# EAGLE design I2C_4CH_PWM_MODULE (EAGLE 9.6.2)
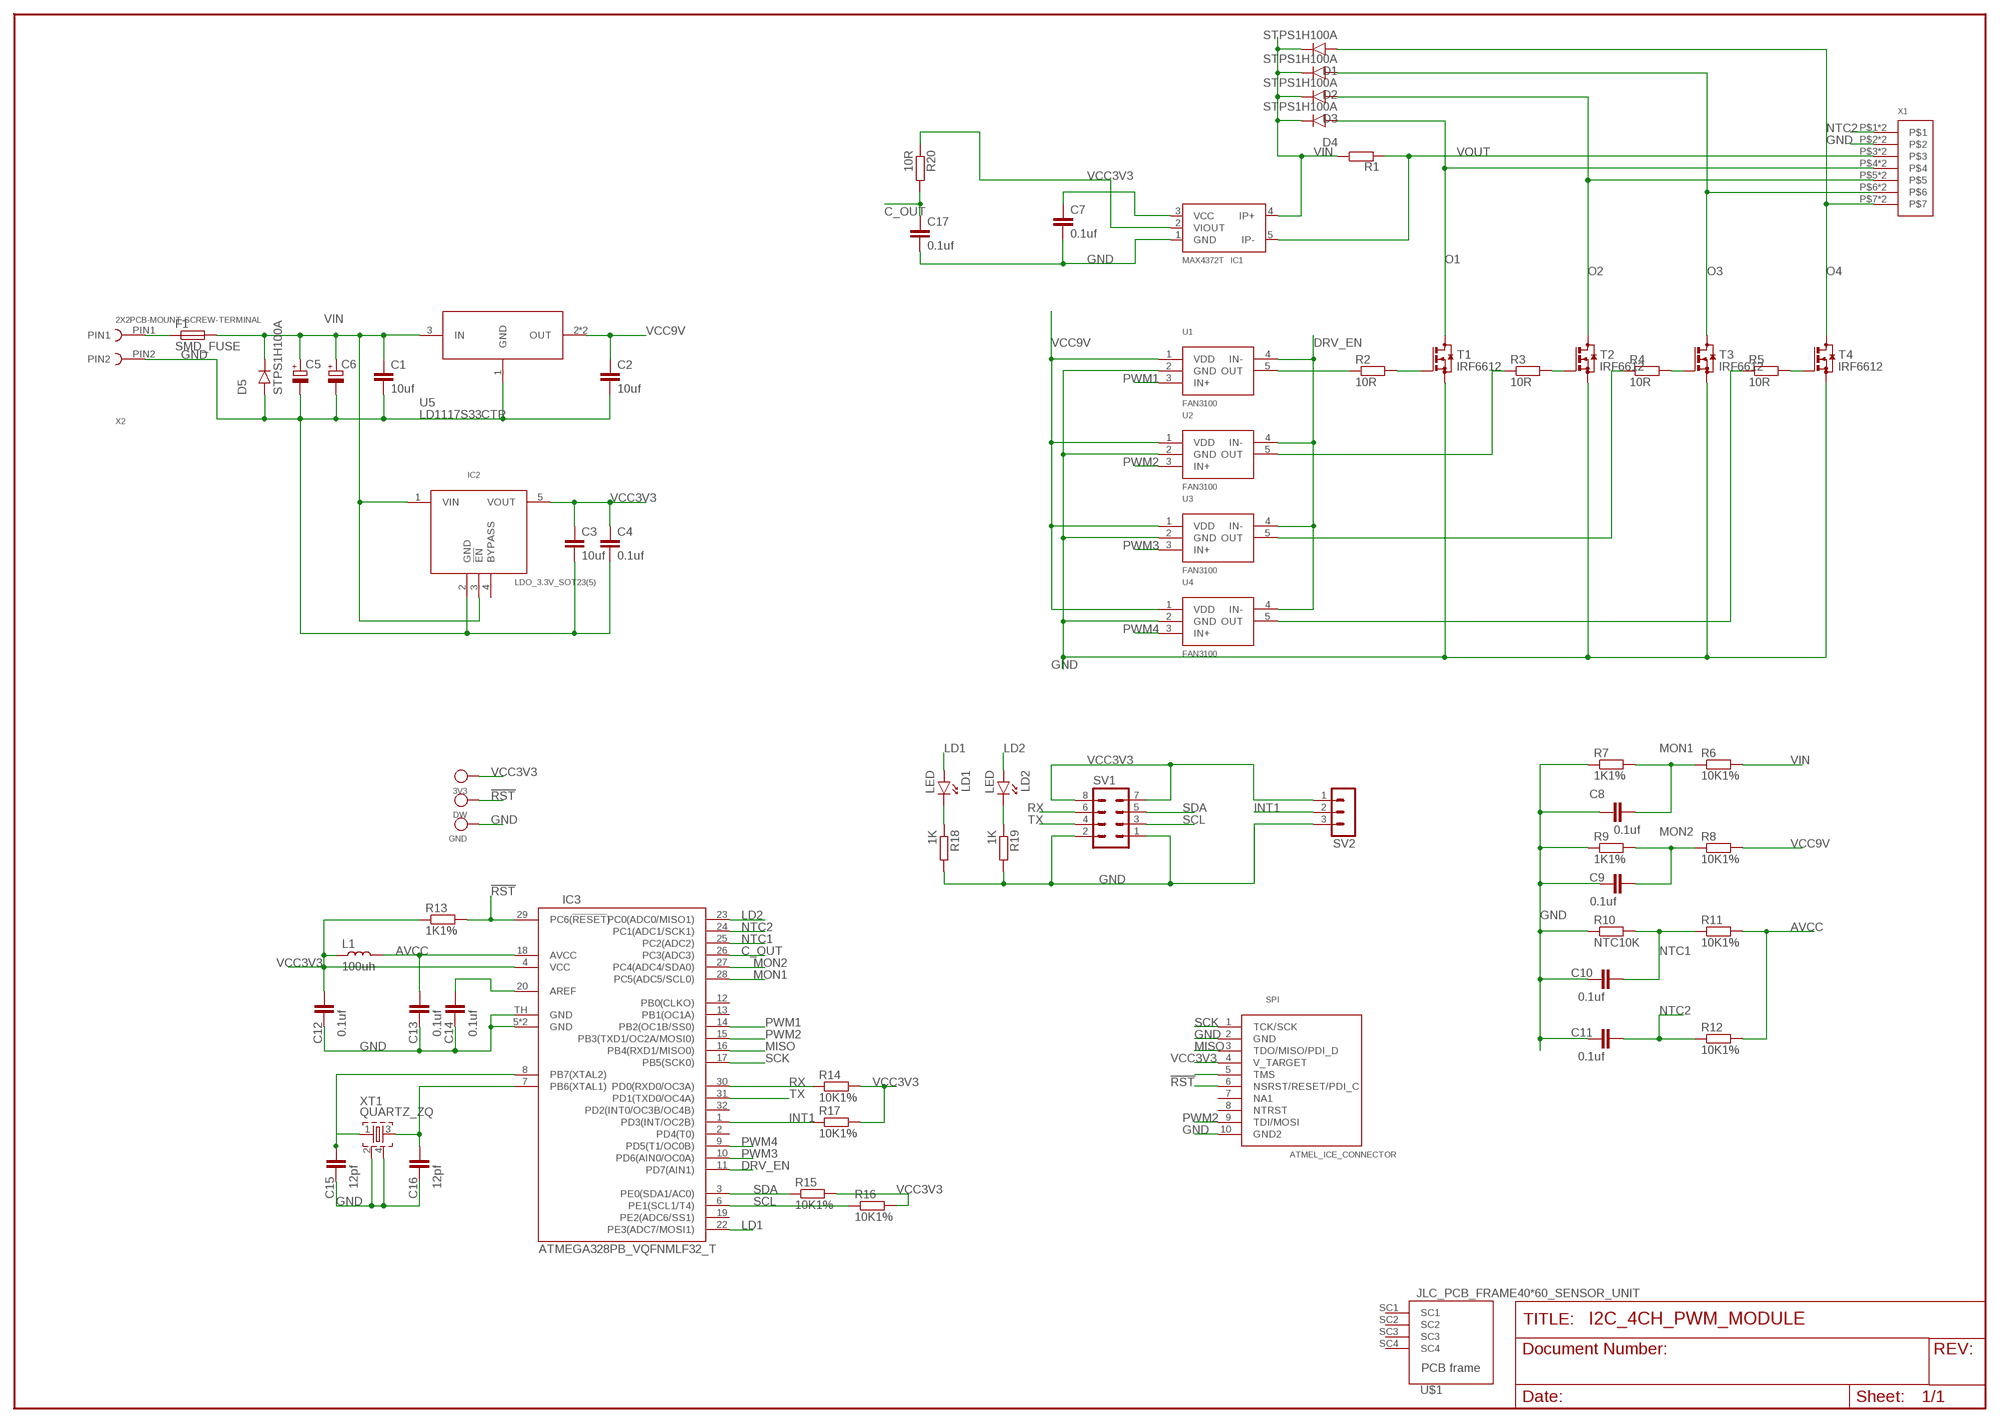
[diagram p0: schematic, sheet 1]

## Parts
3V3  TEST_POINT_D2MM  [TP]
C1  10uf  SMD_C1206  [1206]
C2  10uf  SMD_C1206  [1206]
C3  10uf  SMD_C1206  [1206]
C4  0.1uf  SMD_C0603  [0603]
C5  CPOL-EU153CLV-0605  [153CLV-0605]
C6  CPOL-EU153CLV-0605  [153CLV-0605]
C7  0.1uf  SMD_C0603  [0603]
C8  0.1uf  SMD_C0603  [0603]
C9  0.1uf  SMD_C0603  [0603]
C10  0.1uf  SMD_C0603  [0603]
C11  0.1uf  SMD_C0603  [0603]
C12  0.1uf  SMD_C0603  [0603]
C13  0.1uf  SMD_C0603  [0603]
C14  0.1uf  SMD_C0603  [0603]
C15  12pf  SMD_C0603  [0603]
C16  12pf  SMD_C0603  [0603]
C17  0.1uf  SMD_C0603  [0603]
D1  STPS1H100A  [SMA403D]
D2  STPS1H100A  [SMA403D]
D3  STPS1H100A  [SMA403D]
D4  STPS1H100A  [SMA403D]
D5  STPS1H100A  [SMA403D]
DW  TEST_POINT_D2MM  [TP]
F1  SMD_FUSE  [SMD_2410_FUSE_NOK]
GND  TEST_POINT_D2MM  [TP]
IC1  MAX4372T  [SOT-23(5)]
IC2  LDO_3.3V_SOT23(5)  [SOT-23(5)]
IC3  ATMEGA328PB_VQFNMLF32_T  [MLF32-TH]
L1  100uh  SMD_L0603  [0603]
LD1  LED  [3MM_DIP_LED]
LD2  LED  [3MM_DIP_LED]
R1  SMS-0  [SMS-0]
R2  10R  SMD_R0603  [0603]
R3  10R  SMD_R0603  [0603]
R4  10R  SMD_R0603  [0603]
R5  10R  SMD_R0603  [0603]
R6  10K1%  SMD_R0603  [0603]
R7  1K1%  SMD_R0603  [0603]
R8  10K1%  SMD_R0603  [0603]
R9  1K1%  SMD_R0603  [0603]
R10  NTC10K  SMD_R0603  [0603]
R11  10K1%  SMD_R0603  [0603]
R12  10K1%  SMD_R0603  [0603]
R13  1K1%  SMD_R0603  [0603]
R14  10K1%  SMD_R0603  [0603]
R15  10K1%  SMD_R0603  [0603]
R16  10K1%  SMD_R0603  [0603]
R17  10K1%  SMD_R0603  [0603]
R18  1K  SMD_R0603  [0603]
R19  1K  SMD_R0603  [0603]
R20  10R  SMD_R0603  [0603]
SPI  ATMEL_ICE_CONNECTOR  [MINI10P_SPI/JTAG/PDI]
SV1  MA04-2  [MA04-2]
SV2  MA03-1  [MA03-1]
T1  IRF6612  [DIRECTFET_IRF6612]
T2  IRF6612  [DIRECTFET_IRF6612]
T3  IRF6612  [DIRECTFET_IRF6612]
T4  IRF6612  [DIRECTFET_IRF6612]
U1  FAN3100  [SOT-23(5)]
U2  FAN3100  [SOT-23(5)]
U3  FAN3100  [SOT-23(5)]
U4  FAN3100  [SOT-23(5)]
U5  LD1117S33CTR  [SOT223]
U$1  JLC_PCB_FRAME40*60_SENSOR_UNIT  [40X60_SENSOR_UNIT]
X1  WAGO250_X7  [WAGO250_FP_7X]
X2  2X2PCB-MOUNT-SCREW-TERMINAL  [2X2PCB-MOUNT-SCREW-TERMINAL]
XT1  QUARTZ_ZQ  [QUARTZ_3X3MM]

## Nets
!RST: DW.P$1 IC3.29(PC6(!RESET!)) R13.2 SPI.6(NSRST/RESET/PDI_C)
AVCC: C13.2 IC3.18(AVCC) L1.2 R11.2 R12.2
C_OUT: C17.1 IC3.26(PC3(ADC3)) R20.2
DRV_EN: IC3.11(PD7(AIN1)) U1.4(IN-) U2.4(IN-) U3.4(IN-) U4.4(IN-)
GND: C1.2 C2.2 C3.2 C4.2 C5.- C6.- C7.2 C8.1 C9.1 C10.1 C11.1 C12.1 C13.1 C14.1 C15.1 C16.1 C17.2 D5.P$2(A) GND.P$1 IC1.1(GND) IC2.2(GND) IC3.5(GND) IC3.21(GND) IC3.TH(GND) R7.1 R9.1 R10.1 R18.2 R19.2 SPI.2(GND) SPI.10(GND2) SV1.1 SV1.2 SV2.3 T1.S1(S) T1.S2(S) T2.S1(S) T2.S2(S) T3.S1(S) T3.S2(S) T4.S1(S) T4.S2(S) U1.2(GND) U2.2(GND) U3.2(GND) U4.2(GND) U5.1(GND) X1.P$2 X1.U$2 X2.PIN2 XT1.2 XT1.4
INT1: IC3.1(PD3(INT/OC2B)) R17.1 SV2.2
LD1: IC3.22(PE3(ADC7/MOSI1)) LD1.A
LD2: IC3.23(PC0(ADC0/MISO1)) LD2.A
MISO: IC3.16(PB4(RXD1/MISO0)) SPI.3(TDO/MISO/PDI_D)
MON1: C8.2 IC3.28(PC5(ADC5/SCL0)) R6.1 R7.2
MON2: C9.2 IC3.27(PC4(ADC4/SDA0)) R8.1 R9.2
N$1: LD2.K R19.1
N$2: F1.P$1 X2.PIN1
N$3: C15.2 IC3.8(PB7(XTAL2)) XT1.1
N$4: C16.2 IC3.7(PB6(XTAL1)) XT1.3
N$5: C14.2 IC3.20(AREF)
N$6: LD1.K R18.1
N$7: SPI.5(TMS)
N$8: IC1.2(VIOUT) R20.1
N$10: R2.2 T1.G
N$11: R2.1 U1.5(OUT)
N$12: R3.1 U2.5(OUT)
N$13: R3.2 T2.G
N$14: R4.1 U3.5(OUT)
N$15: R4.2 T3.G
N$16: R5.1 U4.5(OUT)
N$17: R5.2 T4.G
NTC1: C10.2 IC3.25(PC2(ADC2)) R10.2 R11.1
NTC2: C11.2 IC3.24(PC1(ADC1/SCK1)) R12.1 X1.P$1 X1.U$1
O1: D4.P$2(A) T1.D1(D) T1.D2(D) X1.P$4 X1.U$4
O2: D3.P$2(A) T2.D1(D) T2.D2(D) X1.P$5 X1.U$5
O3: D2.P$2(A) T3.D1(D) T3.D2(D) X1.P$6 X1.U$6
O4: D1.P$2(A) T4.D1(D) T4.D2(D) X1.P$7 X1.U$7
PWM1: IC3.14(PB2(OC1B/SS0)) U1.3(IN+)
PWM2: IC3.15(PB3(TXD1/OC2A/MOSI0)) SPI.9(TDI/MOSI) U2.3(IN+)
PWM3: IC3.10(PD6(AIN0/OC0A)) U3.3(IN+)
PWM4: IC3.9(PD5(T1/OC0B)) U4.3(IN+)
RX: IC3.30(PD0(RXD0/OC3A)) R14.1 SV1.6
SCK: IC3.17(PB5(SCK0)) SPI.1(TCK/SCK)
SCL: IC3.6(PE1(SCL1/T4)) R16.1 SV1.3
SDA: IC3.3(PE0(SDA1/AC0)) R15.1 SV1.5
TX: IC3.31(PD1(TXD0/OC4A)) SV1.4
VCC3V3: 3V3.P$1 C3.1 C4.1 C7.1 C12.2 IC1.3(VCC) IC2.5(VOUT) IC3.4(VCC) L1.1 R13.1 R14.2 R15.2 R16.2 R17.2 SPI.4(V_TARGET) SV1.7 SV1.8 SV2.1
VCC9V: C2.1 R8.2 U1.1(VDD) U2.1(VDD) U3.1(VDD) U4.1(VDD) U5.2(OUT) U5.4(OUT)
VIN: C1.1 C5.+ C6.+ D1.P$1(C) D2.P$1(C) D3.P$1(C) D4.P$1(C) D5.P$1(C) F1.P$2 IC1.4(IP+) IC2.1(VIN) IC2.3(!EN!) R1.1 R6.2 U5.3(IN)
VOUT: IC1.5(IP-) R1.2 X1.P$3 X1.U$3
Unconnected: IC2.4(BYPASS) IC3.2(PD4(T0)) IC3.12(PB0(CLKO)) IC3.13(PB1(OC1A)) IC3.19(PE2(ADC6/SS1)) IC3.32(PD2(INT0/OC3B/OC4B)) SPI.7(NA1) SPI.8(NTRST) U$1.SC1 U$1.SC2 U$1.SC3 U$1.SC4

## Library data of the parts
3V3 DW GND = passive_components:TEST_POINT_D2MM
C1-C4 C7-C17 = passive_components:SMD_C
C5 C6 = rcl:CPOL-EU: POLARIZED CAPACITOR, European symbol
D1-D5 = passive_components:STPS1H100A
F1 = passive_components:SMD_FUSE
IC1 = my_IC:MAX4372T
IC2 = passive_components:LDO_3.3V_SOT23(5)
IC3 = my_IC:ATMEGA328PB_VQFN
L1 = passive_components:SMD_L
LD1 LD2 = passive_components:LED
R1 = resistor-shunt:SMS-0: SMD SHUNT RESISTOR; OC_FARNELL: unknown; OC_NEWARK: unknown
R2-R20 = passive_components:SMD_R
SPI = passive_components:ATMEL_ICE_CONNECTOR
SV1 = con-lstb:MA04-2: PIN HEADER; OC_FARNELL: unknown; OC_NEWARK: unknown
SV2 = con-lstb:MA03-1: PIN HEADER; OC_FARNELL: unknown; OC_NEWARK: unknown
T1-T4 = passive_components:IRF6612
U1-U4 = passive_components:FAN3100
U5 = LD1117S33CTR:LD1117S33CTR: http://octopart.com/ld1117s33tr-stmicroelectronics-526708 Check availability <https://pricing.snapeda.com/parts/LD1117S33CTR/STMicroelectronics/view-part?ref=eda>; AVAILABILITY: In Stock; DESCRIPTION: Linear Voltage Regulator IC Positive Fixed 1 Output 800mA SOT-223; MF: STMicroelectronics; MP: LD1117S33CTR; PACKAGE: SOT-223 STMicroelectronics; PRICE: None; PURCHASE-URL: https://pricing.snapeda.com/search/part/LD1117S33CTR/?ref=eda
U$1 = passive_components:JLC_PCB_FRAME
X1 = Custom connectors:WAGO250_X7
X2 = Custom connectors:2X2PCB-MOUNT-SCREW-TERMINAL
XT1 = passive_components:QUARTZ_ZQ

## Board
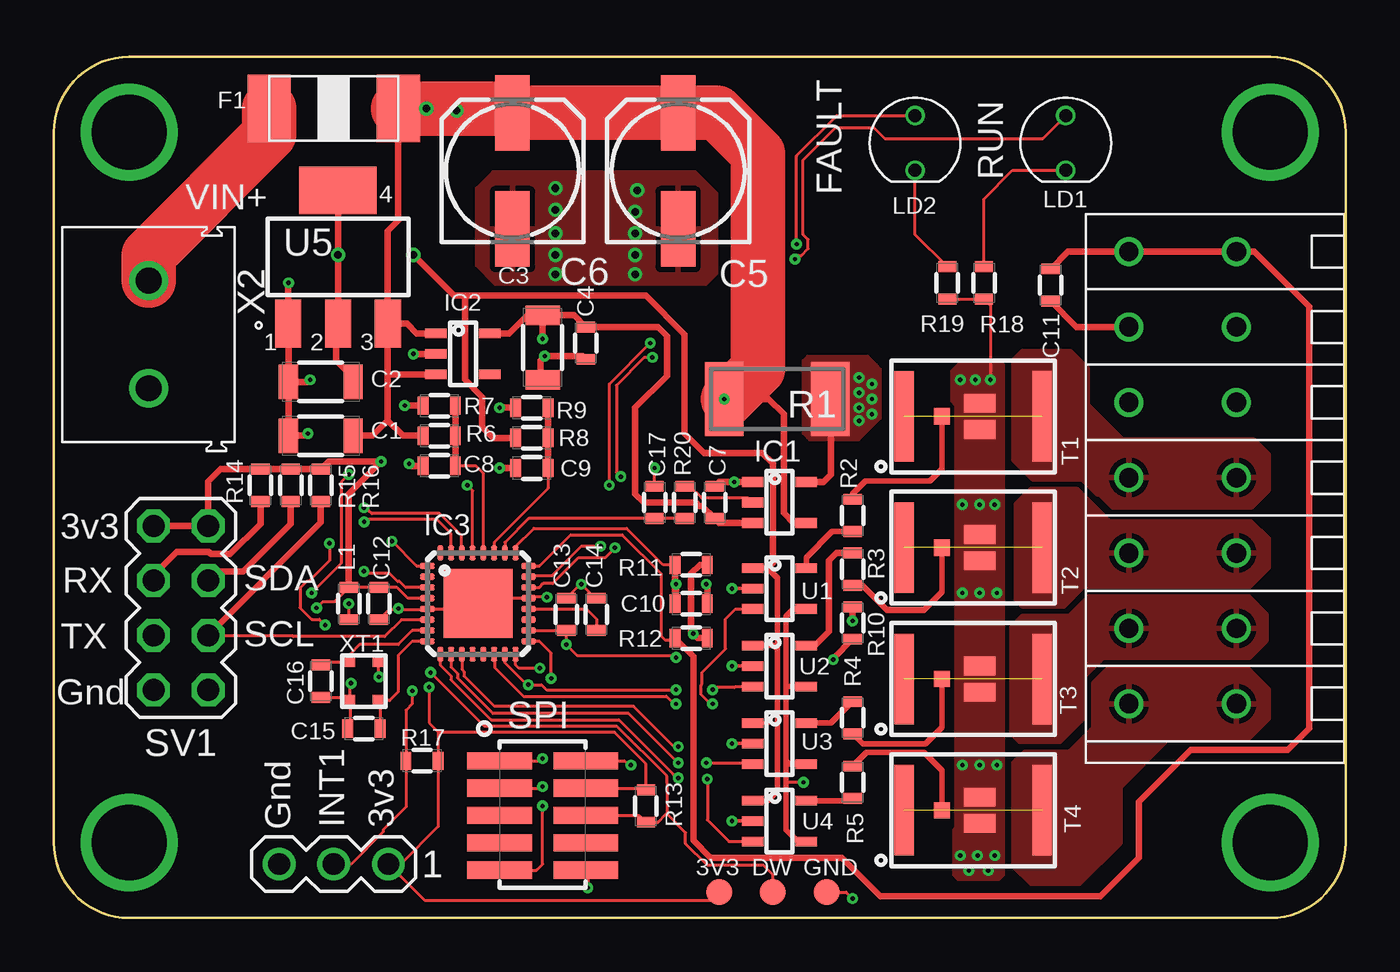
[diagram p1: board, top side]
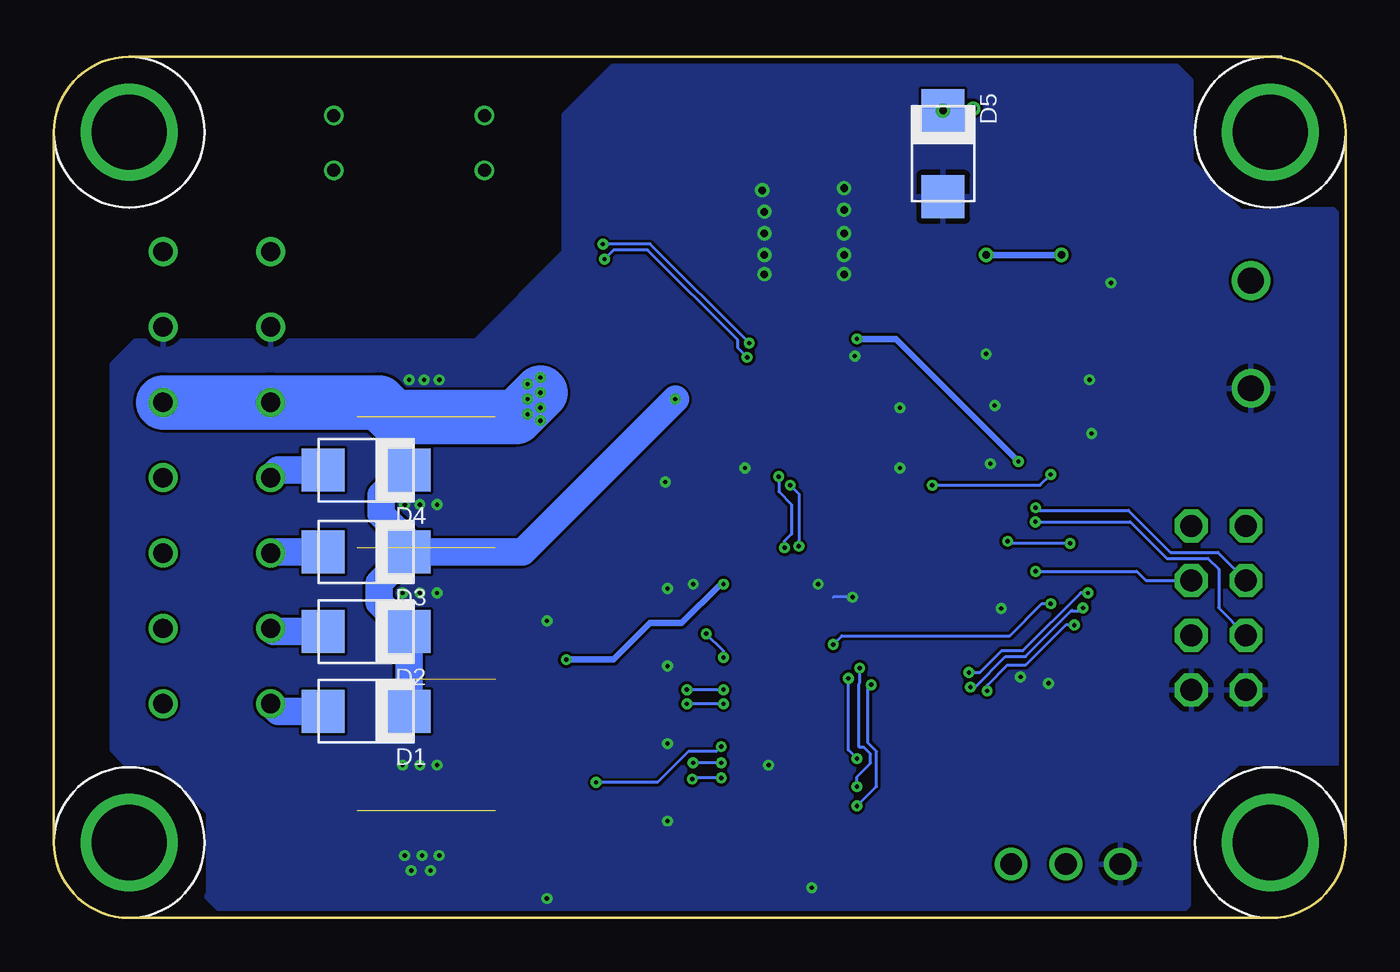
[diagram p2: board, bottom side, seen from below]

Size 60 x 40 mm. Coordinates in mm from the lower left corner, seen from the top.
Copper layers (1*16): Top 0.035mm / dielectric 1.5mm / Bottom 0.035mm
Design rules "default": minimum track width 5mil, minimum drill 0.2mm, track to track 5mil, track to pad 6mil, pad to pad 6mil, via to via 6mil, smd to smd 6mil, copper to edge 10mil, drill to drill 0.4mm, minimum pad ring 6mil, minimum via ring 6mil, stop-mask expansion 4mil, vias tented up to drill 20mil, thermal gap 10mil

### Footprints (pad centres in the part's own frame; a part is rotated, then mirrored left to right if it is on the bottom)
TP = smd 1.2 x 1.2: P$1 0,0
1206 = smd 1.6 x 0.9: 1 0,1.5; 2 0,-1.5
0603 = smd 0.85 x 0.5: 1 0,0.75; 2 0,-0.75
153CLV-0605 = smd 3.5 x 1.6: + 2.7,0; - -2.7,0
SMA403D = smd 2 x 2: P$1 -2,0; P$2 2,0
SMD_2410_FUSE_NOK = smd 2 x 3.15: P$1 -3,0; P$2 3,0
SOT-23(5) = smd 0.45 x 1: 1 -0.95,-1.25; 2 0,-1.25; 3 0.95,-1.25; 4 0.95,1.25; 5 -0.95,1.25
MLF32-TH = smd 0.7 x 0.3: 1 -2.35,1.75; 2 -2.35,1.25; 3 -2.35,0.75; 4 -2.35,0.25; 5 -2.35,-0.25; 6 -2.35,-0.75; 7 -2.35,-1.25; 8 -2.35,-1.75; 17 2.35,-1.75; 18 2.35,-1.25; 19 2.35,-0.75; 20 2.35,-0.25; 21 2.35,0.25; 22 2.35,0.75; 23 2.35,1.25; 24 2.35,1.75 | smd 0.3 x 0.7: 9 -1.75,-2.35; 10 -1.25,-2.35; 11 -0.75,-2.35; 12 -0.25,-2.35; 13 0.25,-2.35; 14 0.75,-2.35; 15 1.25,-2.35; 16 1.75,-2.35; 25 1.75,2.35; 26 1.25,2.35; 27 0.75,2.35; 28 0.25,2.35; 29 -0.25,2.35; 30 -0.75,2.35; 31 -1.25,2.35; 32 -1.75,2.35 | smd 3.2 x 3.2: TH 0,0
3MM_DIP_LED = drill 0.6: A 1.27,0; K -1.27,0
SMS-0 = smd 1.8 x 3.45: 1 2.464,0; 2 -2.464,0
MINI10P_SPI/JTAG/PDI = smd 0.8 x 3: 1 0,-4; 2 0,0; 3 1.27,-4; 4 1.27,0; 5 2.54,-4; 6 2.54,0; 7 3.81,-4; 8 3.81,0; 9 5.08,-4; 10 5.08,0
MA04-2 = drill 1.016 octagon: 1 -3.81,-1.27; 2 -3.81,1.27; 3 -1.27,-1.27; 4 -1.27,1.27; 5 1.27,-1.27; 6 1.27,1.27; 7 3.81,-1.27; 8 3.81,1.27
MA03-1 = drill 1.016: 1 -2.54,0; 2 0,0; 3 2.54,0
DIRECTFET_IRF6612 = smd 0.9 x 4.2: D1 -3.21,0; D2 3.21,0 | smd 0.75 x 0.75: G -1.455,0 | smd 1.45 x 0.87: S1 0.295,0.61; S2 0.295,-0.61
SOT223 = smd 2.235 x 1.219: 1 -3.099,2.311; 2 -3.099,0; 3 -3.099,-2.311 | smd 2.2 x 3.6: 4 3.099,0
40X60_SENSOR_UNIT = drill 3.5: SC1 3.5,56.5; SC2 36.5,56.5; SC3 3.5,3.5; SC4 36.5,3.5
WAGO250_FP_7X = drill 0.9: P$1 0,5; P$2 3.5,5; P$3 7,5; P$4 10.5,5; P$5 14,5; P$6 17.5,5; P$7 21,5; U$1 0,0; U$2 3.5,0; U$3 7,0; U$4 10.5,0; U$5 14,0; U$6 17.5,0; U$7 21,0
2X2PCB-MOUNT-SCREW-TERMINAL = drill 1.2: PIN1 0,2.5; PIN2 0,-2.5
QUARTZ_3X3MM = smd 0.5 x 0.5: 1 -0.65,0.9; 2 0.65,0.9; 3 0.65,-0.9; 4 -0.65,-0.9

### Placement (x,y rotation side)
3V3  30.9,1.2 0 top
C1  12.4,22.4 270 top
C2  12.4,24.9 270 top
C3  22.7,26.5 0 top
C4  24.7,26.7 0 top
C5  29,34.7 90 top
C6  21.3,34.7 90 top
C7  30.7,19.3 180 top
C8  17.9,21 90 top
C9  22.2,20.9 90 top
C10  29.6,14.6 270 top
C11  46.3,29.4 180 top
C12  15.1,14.6 180 top
C13  23.8,14.1 0 top
C14  25.2,14.1 0 top
C15  14.4,8.8 90 top
C16  12.4,11 180 top
C17  27.9,19.3 180 top
D1  45.5,9.6 180 bottom
D2  45.5,13.3 180 bottom
D3  45.5,17 180 bottom
D4  45.5,20.8 180 bottom
D5  18.7,35.5 270 bottom
DW  33.4,1.2 0 top
F1  13,37.6 0 top
GND  35.9,1.2 0 top
IC1  33.7,19.3 270 top
IC2  19,26.2 270 top
IC3  19.7,14.6 0 top
L1  13.7,14.6 0 top
LD1  47,36 90 top
LD2  40,36 90 top
R1  33.6,24.1 180 top
R2  37.1,18.7 180 top
R3  37.1,16.2 0 top
R4  37.1,9.3 0 top
R5  37.1,6.3 180 top
R6  17.9,22.4 270 top
R7  17.9,23.8 90 top
R8  22.2,22.3 270 top
R9  22.2,23.7 90 top
R10  37.1,13.7 0 top
R11  29.6,16.4 90 top
R12  29.6,13 90 top
R13  27.5,5.2 0 top
R14  9.6,20.1 180 top
R15  11,20.1 180 top
R16  12.4,20.1 180 top
R17  17.1,7.3 90 top
R18  43.2,29.5 0 top
R19  41.5,29.5 0 top
R20  29.3,19.3 0 top
SPI  24.7,7.3 270 top
SV1  5.9,14.4 90 top
SV2  13,2.5 180 top
T1  42.7,23.3 0 top
T2  42.7,17.2 0 top
T3  42.7,11.1 0 top
T4  42.7,5 0 top
U1  33.7,15.3 270 top
U2  33.7,11.7 270 top
U3  33.7,8.1 270 top
U4  33.7,4.5 270 top
U5  13.2,30.7 90 top
U$1  0,0 90 bottom
X1  49.93,30.95 270 top
X2  4.4,27.1 0 top
XT1  14.4,11 180 top

### Tracks (layer width: path | path; a pad name or v marks a point on that pad's centre or on a via)
!RST  (via drill 0.2)
  Top 0.15: SPI.6 27.19,4.76 R13.2 28.05,4.45 28.45,4.85 | 28.45,4.85 28.5,4.9 28.5,6.25 28.47,6.28 28.47,6.59 26.16,8.9 20,8.9 v17.5,11.4 | IC3.29 19.45,19.85 v19.2,20.1 | v13.7,20.6 13.35,20.25 13.35,16.48 v11.97,15.1 | DW.P$1 33.4,2 32.95,2.45 30.35,2.45 29.35,3.45 29.35,3.95 28.45,4.85
  Bottom 0.15: v17.5,11.4 17,11.4 15.98,12.42 14.98,12.42 12.31,15.1 v11.97,15.1 | v19.2,20.1 14.2,20.1 v13.7,20.6
AVCC  (via drill 0.2)
  Top 0.15: IC3.18 C13.2 v23.8,12.7 24.3,12.2 28.79,12.2 v28.89,12.1 | v13.7,14.6 L1.2
  Top 0.305: R12.2 29.9,13 v29.7,13.2 29.6,13.3 29.6,16 30,16.4 R11.2
  Bottom 0.15: v23.8,12.7 23.4,13.1 15.6,13.1 14.1,14.6 v13.7,14.6 | v28.89,12.1 28.89,12.39 v29.7,13.2
C_OUT
  Top 0.15: IC3.26 20.95,17.45 22.05,18.55 C17.1 R20.2
DRV_EN  (via drill 0.2)
  Top 0.15: IC3.11 18.95,11.55 19.05,11.45 19.05,11.24 20.46,9.83 26.93,9.83 28.8,7.96 v29,7.96 | v34.82,6.3 34,6.3
  Top 0.254: U4.4 34.55,3.55 34,4.1 34,6.3 34,7.3 | U1.4 34.35,14.35 34,14 34,10.7 | 34,7.3 34,10.7 | U2.4 34.05,10.75 34,10.7 | U3.4 34.15,7.15 34,7.3
  Bottom 0.15: v29,7.96 29.23,7.73 30.53,7.73 31.96,6.3 v34.82,6.3
GND  (via drill 0.2, 0.35)
  Top 0.15: C12.1 15.55,14.3 16.08,14.3 | 16.08,14.3 17.3,14.3 IC3.5 19.45,14.35 IC3.TH 19.95,14.85 IC3.21 22.1,14.9 v22.9,14.9 | XT1.4 15.05,11.25 v15.1,11.2 | C16.1 13.6,10.25 XT1.2 | XT1.2 13.75,8.9 C15.1 | XT1.2 13.75,10.85 v13.8,10.9 | C13.1 24.45,15.5 v24.5,15.5 25.15,14.85 C14.1 | v26.8,7.1 26.7,7.2 26.6,7.2 26.5,7.3 SPI.2 | SPI.10 24.8,2.12 v24.8,1.4 | 16.08,14.3 v16,14.38 | R19.2 R18.2 43.5,28.45 v43.5,25 | GND.P$1 36.8,1.2 v37.1,0.9 | C17.2 v27.9,20.9
  Top 0.152: U1.2 v31.5,15.3 | U2.2 v31.5,11.7 | U3.2 v31.5,8.1 | U4.2 v31.5,4.5
  Top 0.305: C2.2 C1.2 11.7,22.4 v11.8,22.5 | C2.2 U5.1 10.89,29.49 v10.9,29.5 | C2.2 11.8,24.9 v11.9,25 | IC2.2 v16.7,26.2 | C3.2 22.6,25.1 22.6,25.9 v22.8,26.1 24.55,26.1 C4.2 | C7.2 30.9,20.25 v31.6,20.25 IC1.1 | C8.1 16.6,21 v16.5,21.1 | R7.1 v16.3,23.8 | R9.1 v20.7,23.7 | C9.1 v20.7,20.9 | R10.1 v37.1,13.8 | X1.U$2 47.5,27.45 C11.1 | v30.3,15.5 30.35,15.45 C10.1
  Bottom 0.15: v22.9,14.9 23.8,14.9
  other vias: 42.1,25 42.8,25 42.2,19.2 43,19.2 43.7,19.2 42.2,15.1 43,15.1 43.8,15.1 42.2,7.1 43,7.1 43.8,7.1 42.1,2.9 42.9,2.9 43.7,2.9 42.5,2.2 43.4,2.2 23.3,33.9 23.3,32.9 23.3,31.8 23.3,30.8 23.3,29.9 27,29.9 27,30.8 27,31.8 27,32.8 27.1,33.8
  pour Bottom: 3.4,32.8 4.9,32.8 7.2,35.1 7.2,38.9 8,39.7 33.9,39.7 36.3,37.3 36.3,30.9 40.4,26.8 56.2,26.8 57.3,25.7 57.3,7.8 56.7,7.2 55.1,7.2 52.8,4.9 52.8,1.1 52.9,1 52.2,0.3 7.6,0.3 7.3,0.6 7.3,4.9 5,7.2 0.4,7.2 0.4,32.7 0.6,32.9 3.3,32.9
  pour Top: 44.1,25.7 44.1,2 43.9,1.8 42,1.8 41.8,2 41.8,4.1 41.9,4.2 41.9,23.8 41.7,24 41.7,25.4 41.9,25.6 42.2,25.9 43.5,25.9 43.9,25.9
  pour Top: 20.4,34.7 29.8,34.7 30.8,33.7 30.8,29.9 30.3,29.4 20.5,29.4 19.6,30.3 19.6,33.9
INT1  (via drill 0.2)
  Top 0.15: v15.7,17.5 16.85,16.35 IC3.1 | SV2.2 13.8,2.5 15.3,4 15.3,4.1 16.35,5.15 R17.1 16.35,9.65 16.65,9.95 v16.65,10.55 | v12.8,17.4 12.8,16.6 11.83,15.63 11.75,15.63 11.44,15.32 11.44,14.41 11.98,13.87 12.33,13.87 v12.6,13.6
  Bottom 0.15: v12.8,17.4 15.6,17.4 v15.7,17.5 | v12.6,13.6 13,13.6 14.87,11.73 15.73,11.73 16.65,10.81 v16.65,10.55
LD1  (via drill 0.2)
  Top 0.15: v26.06,17.2 26.07,17.19 25.62,16.74 24.38,16.74 23.17,15.53 22.73,15.53 22.55,15.35 IC3.22 | v26.33,20.5 26.13,20.7 26.13,24.74 27.43,26.04 v27.8,26.04 | v34.43,30.6 34.59,30.77 34.72,30.77 35.03,31.08 35.03,31.52 34.8,31.75 34.8,35.2 36.3,36.7 38.1,36.7 38.6,36.2 45.93,36.2 LD1.A
  Bottom 0.15: v26.06,17.2 26.06,17.5 25.73,17.83 25.73,19.2 26.33,19.8 v26.33,20.5 | v27.8,26.04 28.23,26.47 28.23,26.84 32.41,31.02 34,31.02 v34.43,30.6
LD2  (via drill 0.2)
  Top 0.15: IC3.23 22.1,15.9 23.15,15.9 24.52,17.27 v25.4,17.27 | v25.8,20.1 25.8,24.8 v27.7,26.7 | v34.5,31.3 34.5,35.4 36.37,37.27 LD2.A
  Bottom 0.15: v25.8,20.1 25.4,19.7 v25.4,17.27 | v27.7,26.7 32.3,31.3 v34.5,31.3
MISO  (via drill 0.2)
  Top 0.15: SPI.3 22.63,6.03 v22.7,6.1 | v22.57,11.6 21.6,11.6 21.45,11.75 IC3.16
  Bottom 0.15: v22.7,6.1 22.7,6.55 22.07,7.18 22.07,7.62 22.38,7.93 22.6,7.93 22.6,10.88 22.57,10.91 v22.57,11.6
MON1
  Top 0.15: IC3.28 19.95,20.65 19.6,21 C8.2
  Top 0.305: C8.2 R6.1 R7.2
MON2
  Top 0.15: IC3.27 20.45,17.45 22.95,19.95 C9.2
  Top 0.305: C9.2 R8.1 R9.2
N$1
  Top 0.15: R19.1 40,31.75 LD2.K
N$2
  Top 2.54: X2.PIN1 4.4,30.8 10,36.4 F1.P$1
N$3
  Top 0.15: IC3.8 16.65,12.85 16,12.2 16,10.5 15.6,10.1 XT1.1 15.15,10 C15.2
N$4
  Top 0.15: C16.2 12.55,11.9 XT1.3 13.75,12.25 14.2,12.7 16,12.7 16.65,13.35 IC3.7
N$5
  Top 0.15: IC3.20 24.75,14.35 25.2,13.9 C14.2
N$6
  Top 0.15: R18.1 43.2,33.4 44.53,34.73 LD1.K
N$8
  Top 0.15: IC1.2 32.25,19.5 30.1,19.5 29.55,20.05 R20.1
N$10
  Top 0.254: R2.2 37.1,19.7 37.7,20.3 40.7,20.3 41.24,20.84 T1.G
N$11
  Top 0.254: R2.1 36.15,17.95 34.95,16.75 U1.5
N$12
  Top 0.305: U2.5 35.35,12.65 36,13.3 36,16.6 36.35,16.95 R3.1
N$13
  Top 0.254: T2.G 41.24,15.14 40.4,14.3
  Top 0.305: R3.2 37.55,15.45 38.7,14.3 40.4,14.3
N$14
  Top 0.254: U3.5 36.1,9.05 R4.1
N$15
  Top 0.254: R4.2 37.57,8.08 40.48,8.08 41.24,8.85 T3.G
N$16
  Top 0.254: U4.5 37,5.45 R5.1
N$17
  Top 0.254: R5.2 37.75,7.7 40.4,7.7 41.24,6.86 T4.G
NTC1  (via drill 0.2)
  Top 0.15: IC3.25 21.45,17.25 22.3,18.1 26.6,18.1 28.3,16.4 R11.1
  Top 0.305: R11.1 C10.2 28.9,14.65 v28.9,15.5 | R10.2 36.2,12.05 v36.2,12
  Bottom 0.305: v36.2,12 34,12 32.31,13.69 30.85,13.69 29.04,15.5 v28.9,15.5
NTC2
  Top 0.15: IC3.24 22.55,16.35 24,17.8 26.4,17.8 28.2,16 28.2,13.1 28.38,12.93 28.93,12.93
  Top 0.305: C11.2 47.1,30.95 X1.U$1 X1.P$1 55.75,30.95 58.3,28.4 58.3,8.8 57.3,7.8 52.8,7.8 50.4,5.4 50.4,2.8 48.6,1 38.4,1 36.6,2.8 30.5,2.8 29.7,3.6 29.7,12.15 28.93,12.93 R12.1
O1  (1 unrouted)
  Bottom 1.27: D4.P$2 49.58,20.8 X1.U$4
  pour Top: 44.6,25.9 44.6,21.3 45.5,20.4 47.8,20.4 48.5,19.7 48.6,19.7 49.2,19.1 55.6,19.1 56.4,19.9 56.4,21.5 55.7,22.2 49.6,22.2 48,23.8 48,25.5 47.2,26.3 45,26.3
O2  (1 unrouted)
  Bottom 1.27: D3.P$2 49.88,17 X1.U$5
  pour Top: 45.4,19.9 47.5,19.9 49,18.4 55.6,18.4 56.4,17.6 56.4,16.3 55.5,15.4 47.8,15.4 46.9,14.5 45,14.5 44.7,14.8 44.7,19.2
O3  (1 unrouted)
  Bottom 1.27: D2.P$2 49.78,13.3 X1.U$6
  pour Top: 45,14 47.2,14 48.1,14.9 55.5,14.9 56.3,14.1 56.3,12.9 55.5,12.1 48.7,12.1 47.8,11.2 47.8,9.3 46.7,8.2 44.9,8.2 44.5,8.6 44.5,13.5
O4  (1 unrouted)
  Bottom 1.27: D1.P$2 49.58,9.6 X1.U$7
  pour Top: 44.6,7.2 44.6,2.4 45.4,1.6 47.6,1.6 49.5,3.5 49.5,6.1 51.7,8.3 55.4,8.3 56.4,9.3 56.4,10.6 55.4,11.6 49,11.6 48.3,10.9 48.3,8.8 47.2,7.7 45.1,7.7
PWM1  (via drill 0.2)
  Top 0.15: IC3.14 20.47,12.23 20.47,11.64 21.81,10.3 28.45,10.3 28.68,10.07 28.77,10.07 v28.9,9.94 | v30.6,9.94 30.47,10.07 30.38,10.07 30.07,10.38 30.07,10.82 30.1,10.85 30.1,11.4 31.2,12.5 31.2,13.9 31.65,14.35 U1.3
  Bottom 0.15: v28.9,9.94 v30.6,9.94
PWM2  (via drill 0.2)
  Top 0.15: v30.6,10.6 30.7,10.7 31.6,10.7 31.65,10.75 U2.3 | SPI.9 22.42,2.22 22.7,2.5 v22.7,5.2 | IC3.15 20.95,11.85 21.97,10.83 v22.04,10.83 22.65,10.83 22.88,10.6 v28.9,10.6
  Bottom 0.15: v28.9,10.6 v30.6,10.6 | v22.7,5.2 21.79,6.11 21.79,7.74 22.2,8.14 22.2,10.67 v22.04,10.83
PWM3  (via drill 0.2)
  Top 0.15: IC3.10 18.45,11.65 18.75,11.35 18.75,11.15 20.4,9.5 26.7,9.5 v29,7.2 | v30.31,7.2 32.4,7.2 U3.3
  Bottom 0.15: v29,7.2 v30.31,7.2
PWM4  (via drill 0.2)
  Top 0.15: IC3.9 17.95,11.75 18.45,11.25 18.45,11.06 20.31,9.2 26.25,9.2 28.78,6.67 28.83,6.67 v29,6.5 | v30.35,6.45 30.35,4.55 31.35,3.55 U4.3
  Bottom 0.15: v29,6.5 30.3,6.5 v30.35,6.45
RX  (via drill 0.2)
  Top 0.15: IC3.30 18.93,16.97 18.93,17.76 17.91,18.78 14.78,18.78 14.63,18.93 14.53,18.93 v14.4,19.06
  Top 0.305: SV1.6 4.63,15.93 5.7,17 7.2,17 7.3,16.9 8.2,16.9 9.6,18.3 R14.1
  Bottom 0.15: v14.4,19.06 14.27,18.93 10.09,18.93 8.13,16.98 5.94,16.98 SV1.6
SCK  (via drill 0.2)
  Top 0.15: SPI.1 22.6,7.3 v22.7,7.4 | v23.1,11.13 23.1,12.3 22.55,12.85 IC3.17
  Bottom 0.15: v22.7,7.4 23.1,7.8 v23.1,11.13
SCL
  Top 0.15: IC3.6 16.15,13.85 15.37,13.07 11.13,13.07 11.1,13.1 7.2,13.1 SV1.3
  Top 0.305: SV1.3 12.4,18.36 R16.1
SDA  (via drill 0.2)
  Top 0.15: IC3.3 16.34,15.35 16.07,15.63 15.97,15.63 15.6,16 14.5,16 v14.4,16.1
  Top 0.305: SV1.5 7.6,16.1 8.8,16.1 11,18.3 R15.1
  Bottom 0.15: v14.4,16.1 9.7,16.1 9.27,15.67 SV1.5
TX  (via drill 0.2)
  Top 0.15: IC3.31 18.45,17.85 17.8,18.5 14.51,18.5 v14.41,18.4
  Bottom 0.15: v14.41,18.4 10.01,18.4 8.31,16.7 6.4,16.7 5.9,16.2 5.9,14.4 SV1.4
VCC3V3  (via drill 0.2)
  Top 0.15: IC3.4 16.45,14.85 15.95,15.35 C12.2 L1.1 13.48,15.13 13.05,14.7 12.5,14.7 v12.2,14.4 | SPI.4 27.42,6.03 R13.1 27.5,7.17 26.04,8.62 17.88,8.62 17.85,8.65 | v17.43,10.72 17.43,9.07 17.85,8.65 | 17.85,8.65 R17.2 17.85,4.25 16.1,2.5 SV2.1 17.24,0.8 30.5,0.8 3V3.P$1
  Top 0.305: IC2.5 21.15,27.15 22,28 C3.1 | C3.1 24.15,28 C4.1 28.05,27.45 28.47,27.03 28.47,25.17 27,23.7 27,19.7 27.4,19.3 29.8,19.3 29.95,19.15 30.1,19.15 C7.1 30.9,18.35 IC1.3 | L1.1 13.7,19.7 v15.2,21.2 | v22.7,26.9 C3.1 | v15.2,21.2 15,21 | SV1.8 SV1.7 7.17,20.27 7.75,20.85 R14.2 R15.2 R16.2 12.76,21.21 13.95,21.21 13.96,21.2 v15.2,21.2
  Bottom 0.15: v17.43,10.72 17.23,10.72 15.8,12.15 14.87,12.15 12.76,14.26 | 12.7,14.3 12.72,14.3 12.76,14.26 | 12.76,14.26 12.34,14.26 v12.2,14.4
  Bottom 0.305: v15.2,21.2 20.9,26.9 v22.7,26.9
VCC9V  (via drill 0.35)
  Top 0.15: U3.1 33.55,9.05 33.6,9
  Top 0.254: U4.1 33.15,5.45 33.6,5.9 33.6,9 33.6,12.5 | U1.1 33.15,16.25 33.6,15.8 33.6,12.5 | U2.1 33.45,12.65 33.6,12.5
  Top 0.305: U5.4 v13.2,30.8 U5.2 13.1,27.5 13.1,25.9 13.9,25.1 C2.1 | 33.15,16.25 33.4,16.5 33.4,21.1 32.9,21.6 30.2,21.6 29.3,22.5 29.3,27.1 27.5,28.9 19.1,28.9 | v16.7,30.8 18.6,28.9 19.1,28.9 | R8.2 20.4,22.3 19.9,22.8 19.9,24.2 19.1,25 19.1,28.9
  Bottom 0.305: v16.7,30.8 v13.2,30.8
VIN  (via drill 0.2, 0.35)
  Top 0.305: C1.1 14.8,22.4 15.51,23.11 | 15.51,23.11 15.51,25.3 | 15.51,25.3 U5.3 | IC1.4 34.35,18.35 33.9,18.8 33.9,23.4 33.2,24.1 31.3,24.1 R1.1 | U5.3 15.51,31.91 16,32.4 F1.P$2 | U5.3 16.4,27.6 16.85,27.15 IC2.1 | R6.2 16.22,22.4 15.51,23.11 | IC2.3 15.56,25.25 15.51,25.3 | 18.8,37.6 D5.P$1
  Top 2.54: F1.P$2 v17.3,37.6 18.8,37.6 21.1,37.6 C6.+ C5.+ 30.8,37.4 32.7,35.5 32.7,25.5 31.3,24.1
  Bottom 0.305: D5.P$1 17.4,37.5 v17.3,37.6
  Bottom 1.27: D1.P$1 D2.P$1 44.21,14.01 44.25,14.01 44.89,14.65 44.89,15.55 43.5,16.94 D3.P$1 | D3.P$1 43.5,17.46 44.79,18.75 44.79,19.65 44.15,20.29 44.01,20.29 D4.P$1 | D3.P$1 38.24,17 R1.1
  other vias: 31.14,24.1 18.7,37.5
VOUT  (via drill 0.2)
  Top 0.305: IC1.5 35.75,20.25 36.1,20.6 36.1,24.06 R1.2
  Bottom 2.54: X1.P$3 X1.U$3 44.89,23.95 44.22,23.27 38.53,23.27 v37.4,24.4
  other vias: 37.4,25.1 38,24.8 37.4,23.7 37.4,23.1 38,23.4 38,24.1
  pour Top: 35,26.1 37.8,26.1 38.2,25.7 38.4,25.5 38.4,23.9 38.4,23.2 37.4,22.2 35.1,22.2 35,22.3 34.8,22.5 34.8,25.4 34.8,25.9

### Text on the board
tPlace: FAULT | RUN | VIN+ | 3v3 | RX | SDA | SCL | TX | Gnd | Gnd | INT1 | 3v3